# Altium schematic sheet Safety Logic.SchDoc: Safety Logic
size Letter; Date: 2017-02-10; DocumentNumber: 4; Revision: A; SheetNumber: 4; SheetTotal: 16; DesignedBy: Mike MacKay
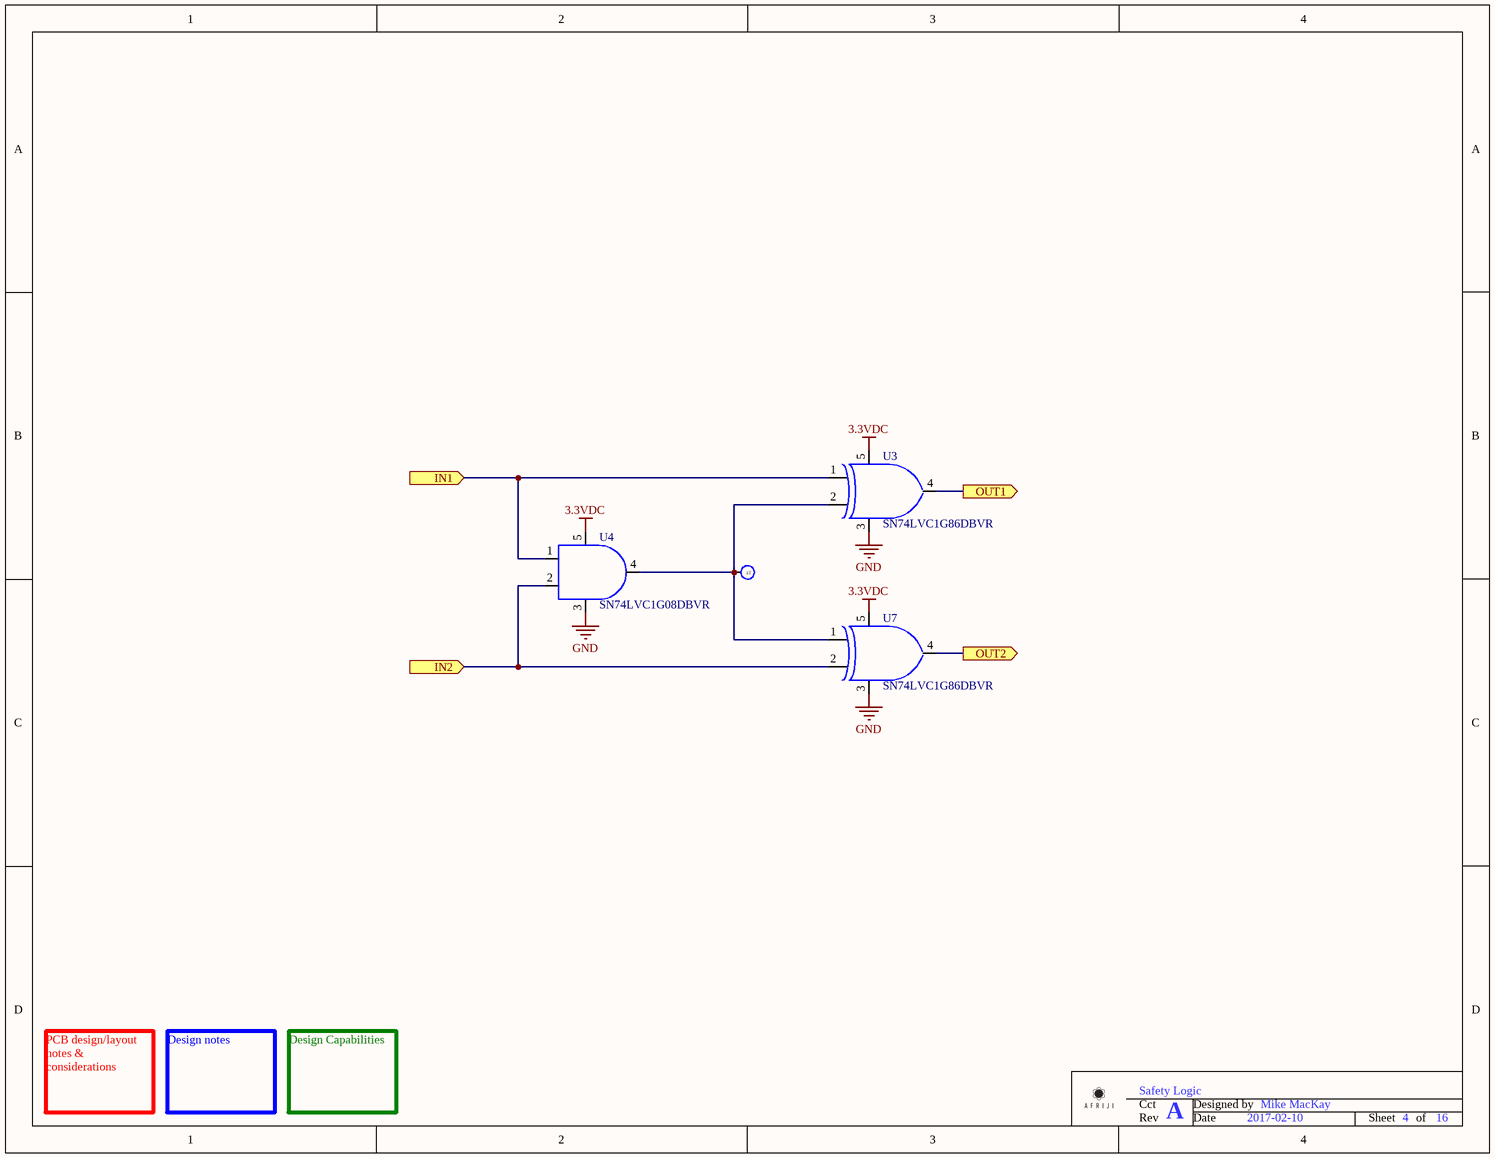
[diagram p0: Safety Logic.SchDoc]

## Parts
TP4  Test Clip  [SMT Test Clip]  (value not drawn)
U3  Manufacturer Part Number: SN74LVC1G86DBVR  [SOT23-5]  (hidden comment: Single XOR Logic Gate)
U4  Manufacturer Part Number: SN74LVC1G08DBVR  [SOT23-5]  (hidden comment: Single AND Logic Gate)
U7  Manufacturer Part Number: SN74LVC1G86DBVR  [SOT23-5]  (hidden comment: Single XOR Logic Gate)

## Ports
IN1 (in), IN2 (in), OUT1 (out), OUT2 (out)

## Nets
3.3VDC: U3.5(Vcc) U4.5(Vcc) U7.5(Vcc)
GND: U3.3(Gnd) U4.3(Gnd) U7.3(Gnd)
IN1: U3.1(A) U4.1(A) ; port IN1
IN2: U4.2(B) U7.2(B) ; port IN2
OUT1: U3.4(Y) ; port OUT1
OUT2: U7.4(Y) ; port OUT2
NetTP4_1: TP4.1 U3.2(B) U4.4(Y) U7.1(A)

## Notes on the sheet
- PCB design/layout notes & considerations
- Design notes
- Design Capabilities
- Cct
- Designed by
- Rev
- Date
- Sheet
- of
- (in symbol Test Clip) Clip; Test

## Library data of the parts
TP4 = Test Clip: Manufacturer: TE Connectivity AMP Connectors; Manufacturer Part Number: RCU-0C; Value: SMT Test Clip; Material - Insulation: No Insulation; Technology: SMT; Supplier 1: Digi-Key; RoHS: RoHS Compliant; Category: Test and Measurement; Stock 1: 58926; Pricing 1: 1=0.31, 10=0.291, 25=0.248, 50=0.217, 100=0.2014, 250=0.1782, 500=0.17046, 1000=0.13947 (CAD); Packaging: Cut Tape (CT); Part Status: Active; Type: PC Test Point; Mounting Type: Surface Mount; Color: Natural; Size / Dimension: 0.063" x 0.031" x 0.045" (1.60mm x 0.80mm x 1.15mm); Plating: -; Material - Body: -; ComponentLink1URL: http://www.te.com/commerce/DocumentDelivery/DDEController?Action=srchrtrv&DocNm=1773266&DocType=DS&DocLang=English; ComponentLink1Description: Spec Sheet; Supplier Part Number 1: A106145CT-ND
U3 U7 = Single XOR Logic Gate: Manufacturer: Texas Instruments; Logic Type: XOR (Exclusive OR); Number of Circuits: 1; Number of Inputs: 2; Voltage - Supply: 1.65 V ~ 5.5 V; Current - Quiescent (Max): 10µA; Current - Output High, Low: 32mA, 32mA; Logic Level - Low: 0.7 V ~ 0.8 V; Logic Level - High: 1.7 V ~ 2 V; Max Propagation Delay @ V, Max CL: 4ns @ 5V, 50pF; Supplier 1: Digi-Key; RoHS: RoHS Compliant; Category: Integrated Circuits (ICs); Stock 1: 19977; Pricing 1: 1=0.36, 10=0.29, 100=0.198, 500=0.1482, 1000=0.111 (USD); Packaging: Cut Tape (CT); Part Status: Active; Features: -; Operating Temperature: -40°C ~ 125°C; Mounting Type: Surface Mount; Supplier Device Package: SOT-23-5; Package / Case: SC-74A, SOT-753; ComponentLink1URL: http://www.ti.com/lit/ds/symlink/sn74lvc1g86.pdf; ComponentLink1Description: Spec Sheet; Supplier Part Number 1: 296-9853-1-ND
U4 = Single AND Logic Gate: Manufacturer: Texas Instruments; Logic Type: AND Gate; Number of Circuits: 1; Number of Inputs: 2; Voltage - Supply: 1.65 V ~ 5.5 V; Current - Quiescent (Max): 10µA; Current - Output High, Low: 32mA, 32mA; Max Propagation Delay @ V, Max CL: 4ns @ 5V, 50pF; Value: Single AND Logic Gate; Supplier 1: Digi-Key; Supplier Part Number 1: 296-11601-1-ND; RoHS: RoHS Compliant; Category: Integrated Circuits (ICs); Stock 1: 17122; Pricing 1: 1=0.42, 10=0.315, 100=0.196, 500=0.134, 1000=0.103 (USD); Packaging: Cut Tape (CT); Part Status: Active; Features: -; Logic Level - Low: -; Logic Level - High: -; Operating Temperature: -40°C ~ 125°C; Mounting Type: Surface Mount; Supplier Device Package: SOT-23-5; Package / Case: SC-74A, SOT-753; ComponentLink1URL: http://www.ti.com/lit/ds/symlink/sn74lvc1g08.pdf; ComponentLink1Description: Spec Sheet